# Altium schematic sheet STM32 Motherboard.SchDoc
size A4
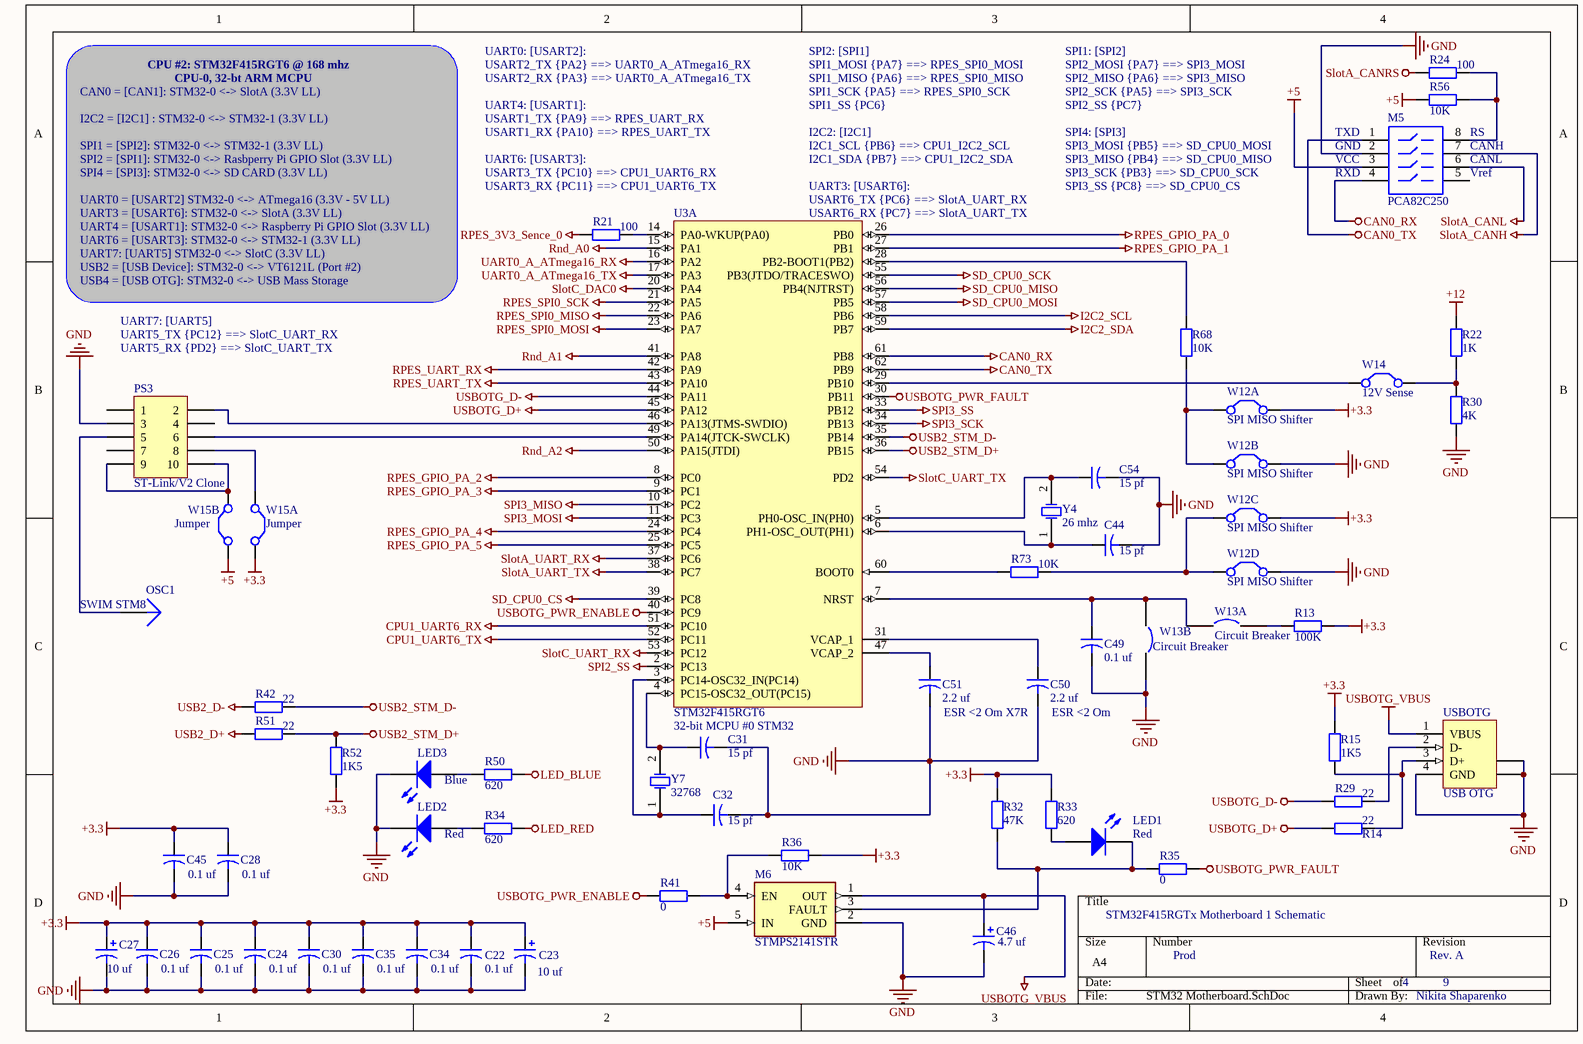
[diagram p0: STM32 Motherboard.SchDoc]

## Parts
C22  value 0.1 uf  [CAPR5-4X5]  (hidden comment: Cap2)
C23  value 10 uf  [RAD-0.2]  (hidden comment: Cap Pol1)
C24  value 0.1 uf  [CAPR5-4X5]  (hidden comment: Cap2)
C25  value 0.1 uf  [CAPR5-4X5]  (hidden comment: Cap2)
C26  value 0.1 uf  [CAPR5-4X5]  (hidden comment: Cap2)
C27  value 10 uf  [RAD-0.2]  (hidden comment: Cap Pol1)
C28  value 0.1 uf  [CAPR5-4X5]  (hidden comment: Cap2)
C30  value 0.1 uf  [CAPR5-4X5]  (hidden comment: Cap2)
C31  value 15 pf  [CAPR5-4X5]  (hidden comment: Cap2)
C32  value 15 pf  [CAPR5-4X5]  (hidden comment: Cap2)
C34  value 0.1 uf  [CAPR5-4X5]  (hidden comment: Cap2)
C35  value 0.1 uf  [CAPR5-4X5]  (hidden comment: Cap2)
C44  value 15 pf  [CAPR5-4X5]  (hidden comment: Cap2)
C45  value 0.1 uf  [CAPR5-4X5]  (hidden comment: Cap2)
C46  value 4.7 uf  [RAD-0.2]  (hidden comment: Cap Pol1)
C49  value 0.1 uf  [CAPR5-4X5]  (hidden comment: Cap2)
C50  ESR <2 Om  value 2.2 uf  [CAPR5-4X5]
C51  ESR <2 Om X7R  value 2.2 uf  [CAPR5-4X5]
C54  value 15 pf  [CAPR5-4X5]  (hidden comment: Cap2)
LED1  Red  [LED-1]
LED2  Red  [LED-1]
LED3  Blue  [LED-1]
M5  PCA82C250  [8S1_N]
M6  STMPS2141STR  [SOT95P280X145-5N]
OSC1  SWIM STM8  [PIN1]
PS3  ST-Link/V2 Clone  [HDR2X5]
R13  value 100K  [AXIAL-0.4]  (hidden comment: Res2)
R14  value 22  [AXIAL-0.4]  (hidden comment: Res2)
R15  value 1K5  [AXIAL-0.4]  (hidden comment: Res2)
R21  value 100  [AXIAL-0.4]  (hidden comment: Res2)
R22  value 1K  [AXIAL-0.4]  (hidden comment: Res2)
R24  value 100  [AXIAL-0.4]  (hidden comment: Res2)
R29  value 22  [AXIAL-0.4]  (hidden comment: Res2)
R30  value 4K  [AXIAL-0.4]  (hidden comment: Res2)
R32  value 47K  [AXIAL-0.4]  (hidden comment: Res2)
R33  value 620  [AXIAL-0.4]  (hidden comment: Res2)
R34  value 620  [AXIAL-0.4]  (hidden comment: Res2)
R35  value 0  [AXIAL-0.4]  (hidden comment: Res2)
R36  value 10K  [AXIAL-0.4]  (hidden comment: Res2)
R41  value 0  [AXIAL-0.4]  (hidden comment: Res2)
R42  value 22  [AXIAL-0.4]  (hidden comment: Res2)
R50  value 620  [AXIAL-0.4]  (hidden comment: Res2)
R51  value 22  [AXIAL-0.4]  (hidden comment: Res2)
R52  value 1K5  [AXIAL-0.4]  (hidden comment: Res2)
R56  value 10K  [AXIAL-0.4]  (hidden comment: Res2)
R68  value 10K  [AXIAL-0.4]  (hidden comment: Res2)
R73  value 10K  [AXIAL-0.4]  (hidden comment: Res2)
U3  STM32F415RGT6  [STM-LQFP64_N]  (part A of 2)
USBOTG  USB OTG  [1470695A]
W12A  SPI MISO Shifter  [RAD-0.1]
W12B  SPI MISO Shifter  [RAD-0.1]
W12C  SPI MISO Shifter  [RAD-0.1]
W12D  SPI MISO Shifter  [RAD-0.1]
W13A  Circuit Breaker  [SPST-2]
W13B  Circuit Breaker  [SPST-2]
W14  12V Sense  [RAD-0.1]
W15A  Jumper  [RAD-0.1]
W15B  Jumper  [RAD-0.1]
Y4  26 mhz  [R38]
Y7  32768  [R38]

## Nets
+3.3: C22.1 C23.1 C24.1 C25.1 C26.1 C27.1 C28.1 C30.1 C34.1 C35.1 C45.1 R13.1 R15.2 R32.2 R33.2 R36.1 R52.1 W12A.2(C2) W12C.2(C2) W15A.2(C2)
+5: M5.3 M6.5(IN) R56.2 W15B.1(C1)
+12: R22.2
CAN0_RX: M5.4 U3.61(PB8)
CAN0_TX: M5.1 U3.62(PB9)
CPU1_UART6_RX: U3.51(PC10)
CPU1_UART6_TX: U3.52(PC11)
GND: C22.2 C23.2 C24.2 C25.2 C26.2 C27.2 C28.2 C30.2 C31.2 C32.2 C34.2 C35.2 C44.2 C45.2 C46.2 C49.2 C50.2 C51.2 C54.2 LED2.2(K) LED3.2(K) M5.2 M6.2(GND) PS3.3 R30.1 USBOTG.4(GND) USBOTG.5(SHLD) USBOTG.6(SHLD) W12B.2(C2) W12D.2(C2) W13B.2
I2C2_SCL: U3.58(PB6)
I2C2_SDA: U3.59(PB7)
LED_BLUE: R50.2
LED_RED: R34.2
Rnd_A0: U3.15(PA1)
Rnd_A1: U3.41(PA8)
Rnd_A2: U3.50(PA15(JTDI))
RPES_3V3_Sence_0: R21.1
RPES_GPIO_PA_0: U3.26(PB0)
RPES_GPIO_PA_1: U3.27(PB1)
RPES_GPIO_PA_2: U3.8(PC0)
RPES_GPIO_PA_3: U3.9(PC1)
RPES_GPIO_PA_4: U3.24(PC4)
RPES_GPIO_PA_5: U3.25(PC5)
RPES_SPI0_MISO: U3.22(PA6)
RPES_SPI0_MOSI: U3.23(PA7)
RPES_SPI0_SCK: U3.21(PA5)
RPES_UART_RX: U3.42(PA9)
RPES_UART_TX: U3.43(PA10)
SD_CPU0_CS: U3.39(PC8)
SD_CPU0_MISO: U3.56(PB4(NJTRST))
SD_CPU0_MOSI: U3.57(PB5)
SD_CPU0_SCK: U3.55(PB3(JTDO/TRACESWO))
SlotA_CANH: M5.7
SlotA_CANL: M5.6
SlotA_CANRS: R24.1
SlotA_UART_RX: U3.37(PC6)
SlotA_UART_TX: U3.38(PC7)
SlotC_DAC0: U3.20(PA4)
SlotC_UART_RX: U3.53(PC12)
SlotC_UART_TX: U3.54(PD2)
SPI2_SS: U3.2(PC13)
SPI3_MISO: U3.10(PC2)
SPI3_MOSI: U3.11(PC3)
SPI3_SCK: U3.34(PB13)
SPI3_SS: U3.33(PB12)
UART0_A_ATmega16_RX: U3.16(PA2)
UART0_A_ATmega16_TX: U3.17(PA3)
USB2_D+: R51.1
USB2_D-: R42.1
USB2_STM_D+: R51.2 R52.2 U3.36(PB15)
USB2_STM_D-: R42.2 U3.35(PB14)
USBOTG_D+: R14.1 U3.45(PA12)
USBOTG_D-: R29.1 U3.44(PA11)
USBOTG_PWR_ENABLE: R41.2 U3.40(PC9)
USBOTG_PWR_FAULT: R35.2 U3.30(PB11)
USBOTG_VBUS: C46.1 M6.1(OUT) USBOTG.1(VBUS)
NetC31_1: C31.1 U3.4(PC15-OSC32_OUT(PC15)) Y7.2(OSC2)
NetC32_1: C32.1 U3.3(PC14-OSC32_IN(PC14)) Y7.1(OSC1)
NetC44_1: C44.1 U3.6(PH1-OSC_OUT(PH1)) Y4.1(OSC1)
NetC49_1: C49.1 U3.7(NRST) W13A.1 W13B.1
NetC50_1: C50.1 U3.31(VCAP_1)
NetC51_1: C51.1 U3.47(VCAP_2)
NetC54_1: C54.1 U3.5(PH0-OSC_IN(PH0)) Y4.2(OSC2)
NetLED1_1: LED1.1(A) R33.1
NetLED1_2: LED1.2(K) M6.3(FAULT) R32.1 R35.1
NetLED2_1: LED2.1(A) R34.1
NetLED3_1: LED3.1(A) R50.1
NetM5_8: M5.8 R24.2 R56.1
NetM6_4: M6.4(EN) R36.2 R41.1
NetOSC1_1: OSC1.1 PS3.5
NetPS3_2: PS3.2 U3.46(PA13(JTMS-SWDIO))
NetPS3_6: PS3.6 U3.49(PA14(JTCK-SWCLK))
NetPS3_8: PS3.8 W15A.1(C1)
NetPS3_9: PS3.9 PS3.10 W15B.2(C2)
NetR13_2: R13.2 W13A.2
NetR14_2: R14.2 R15.1 USBOTG.3(D+)
NetR21_2: R21.2 U3.14(PA0-WKUP(PA0))
NetR22_1: R22.1 R30.2 W14.2(C2)
NetR29_2: R29.2 USBOTG.2(D-)
NetR68_1: R68.1 W12A.1(C1) W12B.1(C1)
NetR68_2: R68.2 U3.28(PB2-BOOT1(PB2))
NetR73_1: R73.1 U3.60(BOOT0)
NetR73_2: R73.2 W12C.1(C1) W12D.1(C1)
NetU3_29: U3.29(PB10) W14.1(C1)

Not connected (* = marked no-connect by the designer): M5 5; PS3 1 4 7

## Notes on the sheet
- CAN0 = [CAN1]: STM32-0 <-> SlotA (3.3V LL)
- CPU #2: STM32F415RGT6 @ 168 mhz
- CPU-0, 32-bt ARM MCPU
- UART0: [USART2]:
- USART2_TX {PA2} ==> UART0_A_ATmega16_RX
- USART2_RX {PA3} ==> UART0_A_ATmega16_TX
- UART4: [USART1]:
- SPI2: [SPI1]
- SPI1_MOSI {PA7} ==> RPES_SPI0_MOSI
- SPI1_MISO {PA6} ==> RPES_SPI0_MISO
- SPI1_SCK {PA5} ==> RPES_SPI0_SCK
- SPI1_SS {PC6}
- SPI1: [SPI2]
- SPI2_MOSI {PA7} ==> SPI3_MOSI
- SPI2_MISO {PA6} ==> SPI3_MISO
- SPI2_SCK {PA5} ==> SPI3_SCK
- SPI2_SS {PC7}
- SPI2 = [SPI1]: STM32-0 <-> Rasbperry Pi GPIO Slot (3.3V LL)
- SPI4 = [SPI3]: STM32-0 <-> SD CARD (3.3V LL)
- I2C2 = [I2C1] : STM32-0 <-> STM32-1 (3.3V LL)
- SPI1 = [SPI2]: STM32-0 <-> STM32-1 (3.3V LL)
- USART1_TX {PA9} ==> RPES_UART_RX
- USART1_RX {PA10} ==> RPES_UART_TX
- UART6: [USART3]:
- USART3_TX {PC10} ==> CPU1_UART6_RX
- I2C2: [I2C1]
- I2C1_SCL {PB6} ==> CPU1_I2C2_SCL
- I2C1_SDA {PB7} ==> CPU1_I2C2_SDA
- SPI4: [SPI3]
- SPI3_MOSI {PB5} ==> SD_CPU0_MOSI
- SPI3_MISO {PB4} ==> SD_CPU0_MISO
- SPI3_SCK {PB3} ==> SD_CPU0_SCK
- (near M5) TXD
- (near M5) GND
- (near M5) VCC
- (near M5) RXD
- RS
- CANH
- (near M5) CANL
- (near M5) Vref
- UART4 = [USART1]: STM32-0 <-> Raspberry Pi GPIO Slot (3.3V LL)
- UART6 = [USART3]: STM32-0 <-> STM32-1 (3.3V LL)
- UART0 = [USART2] STM32-0 <-> ATmega16 (3.3V - 5V LL)
- UART3 = [USART6]: STM32-0 <-> SlotA (3.3V LL)
- USART3_RX {PC11} ==> CPU1_UART6_TX
- (near U3) UART3: [USART6]:
- (near U3) USART6_TX {PC6} ==> SlotA_UART_RX
- (near U3) USART6_RX {PC7} ==> SlotA_UART_TX
- SPI3_SS {PC8} ==> SD_CPU0_CS
- USB4 = [USB OTG]: STM32-0 <-> USB Mass Storage
- USB2 = [USB Device]: STM32-0 <-> VT6121L (Port #2)
- UART7: [UART5] STM32-0 <-> SlotC (3.3V LL)
- UART7: [UART5]
- UART5_TX {PC12} ==> SlotC_UART_RX
- UART5_RX {PD2} ==> SlotC_UART_TX
- (near C31) 32-bit MCPU #0 STM32
- (near R35) STM32F415RGTx Motherboard 1 Schematic
- Prod
- 4
- Rev. A
- 9
- Nikita Shaparenko

## Library data of the parts
C22 C24-C26 C28 C30-C32 C34 C35 C44 C45 C49-C51 C54 = Cap2: Capacitor; Published: 23-Sep-2002; PackageReference: CAPR5-4X5; Publisher: Altium Limited; PackageDescription: Capacitor; 2 Leads
C23 C27 C46 = Cap Pol1: Polarized Capacitor (Radial); Published: 8-Jun-2000; LatestRevisionDate: 17-Jul-2002; LatestRevisionNote: Re-released for DXP Platform.; PackageReference: RB7.6-15; Publisher: Altium Limited; PackageDescription: Polarized Capacitor (Radial); 2 Leads
LED1-LED3 = LED1: Typical RED GaAs LED; Published: 8-Jun-2000; LatestRevisionDate: 08-Jul-2005; LatestRevisionNote: Mech Layer 1 removed.; PackageReference: LED-1; Publisher: Altium Limited; PackageDescription: LED; 2 Leads
M5 = SW-DIP4: DIP Switch; Published: 24-Mar-1999; LatestRevisionDate: 17-Jul-2002; LatestRevisionNote: Re-released for DXP Platform.; PackageReference: DIP-8; Publisher: Altium Limited
M6 = STMPS2141STR: Power Switch/Driver 1:1 N-Channel 500mA SOT-23-5; MF: STMicroelectronics; Price: None; MP: STMPS2141STR; Package: SOT-23 STMicroelectronics; Value: *; Availability: Unavailable; SnapEDA_Link: https://www.snapeda.com/parts/STMPS2141STR/STMicroelectronics/view-part/278790/?ref=snap
OSC1 = Plug: LatestRevisionDate: 17-Jul-2002; LatestRevisionNote: Re-released for DXP Platform.; Publisher: Altium Limited
PS3 = Header 5X2: Header, 5-Pin, Dual row; LatestRevisionDate: 17-Jul-2002; LatestRevisionNote: Re-released for DXP Platform.; Publisher: Altium Limited
R13-R15 R21 R22 R24 R29 R30 R32-R36 R41 R42 R50-R52 R56 R68 R73 = Res2: Resistor; Published: 8-Jun-2000; LatestRevisionDate: 17-Jul-2002; LatestRevisionNote: Re-released for DXP Platform.; PackageReference: AXIAL-0.4; Publisher: Altium Limited; PackageDescription: Axial Device, Thru-Hole; 2 Leads; 0.4 in Pin Spacing
U3 = STM32F415RGT6: ARM Cortex-M4 32-bit MCU+FPU, 210 DMIPS, 1024 kB Flash, 192 kB Internal RAM, 51 I/Os, 64-pin LQFP, -40 to 85 degC, Tray; Manufacturer: STMicroelectronics; D/A Converter: 2x12-bit; FLASH Size (Prog) (kB): 1024; I/Os (High Current): 51; Internal RAM Size (kB): 192; Operating Frequency(F) (Processor speed) (MHz): 168; Supply Voltage(Vcc) max (V): 3.6; Supply Voltage(Vcc) min (V): 1.8; DatasheetVersion: Rev. 4; PackageVersion: Rev. 4, 06/2013; PackageReference: LQFP64; PackageDescription: 64-Pin Low Profile Quad Flat Package, 10 x 10 mm Body, 0.5 mm Pitch; Supplier 1: Digi-Key; Supplier Part Number 1: 497-11907-ND; Supplier 2: Farnell; Supplier Part Number 2: 2064370; Supplier 3: Newark; Supplier Part Number 3: 73T2335; Supplier 4: Mouser; Supplier Part Number 4: 511-STM32F415RGT6; Core: ARM Cortex-M4; Packing: Tray; Mounting Technology: Surface Mount; PartNumber: STM32F415RGT6; ComponentLink1Description: Manufacturer URL; ComponentLink1URL: http://www.st.com/web/en/home.html; ComponentLink2Description: Datasheet; ComponentLink2URL: http://www.st.com/st-web-ui/static/active/en/resource/technical/document/datasheet/DM00035129.pdf; ComponentLink3Description: Package Specification; ComponentLink3URL: http://www.st.com/st-web-ui/static/active/en/resource/technical/document/datasheet/DM00037051.pdf
USBOTG = 1470695-2: USB 1.1, Right Angle, SMT, A Type, Plug, 4 Position, Natural; ContactMaterial: Brass; ContactPlating: Gold (30) over Nickel (50); PCB_Layout: Complies with manufacturer's recommendation.; DrillSize: Corresponds to nominal value.; PanelGround: Without; Published: 15-Jul-2004; DatasheetDocument: 21-Jan-2003; PackageDocument: 21-Jan-2003; PackageReference: 1470695A; Publisher: Altium Limited; HousingMaterial: Thermoplastic; ComponentLink1Description: Manufacturer Link; ComponentLink1URL: http://www.tycoelectronics.com/; ComponentLink2Description: Packaging Specification; ComponentLink2URL: http://ecommas.tycoelectronics.com/commerce/DocumentDelivery/DDEController?Action=showdoc&DocId=Customer+Drawing%7F1470695%7FO%7Fpdf%7FEnglish%7FC_1470695_O.pdf
W12A W12B W12C W12D W14 W15A W15B = Jumper: Jumper Wire; Published: 24-Mar-1999; LatestRevisionDate: 17-Jul-2002; LatestRevisionNote: Re-released for DXP Platform.; PackageReference: RAD-0.2; Publisher: Altium Limited; PackageDescription: Radial Cap, Thru-Hole; 2 Leads; 0.2 in Pin Spacing
Y4 Y7 = XTAL: Crystal Oscillator; Published: 8-Jun-2000; LatestRevisionDate: 17-Jul-2002; LatestRevisionNote: Re-released for DXP Platform.; PackageReference: R38; Publisher: Altium Limited; PackageDescription: Crystal, Thru-Hole; 2 Leads; Body 3.1 x 8.2 mm (Dia.xH)
W13A W13B = Circuit Breaker: Published: 24-Mar-1999; LatestRevisionDate: 17-Jul-2002; LatestRevisionNote: Re-released for DXP Platform.; PackageReference: SPST-2; Publisher: Altium Limited; PackageDescription: Switch; 2 Leads